# EAGLE schematic Stealthboard TMC2100 (EAGLE 8.1.0)

## Sheet 1 of 6: ICU- LPC1769/ VIN
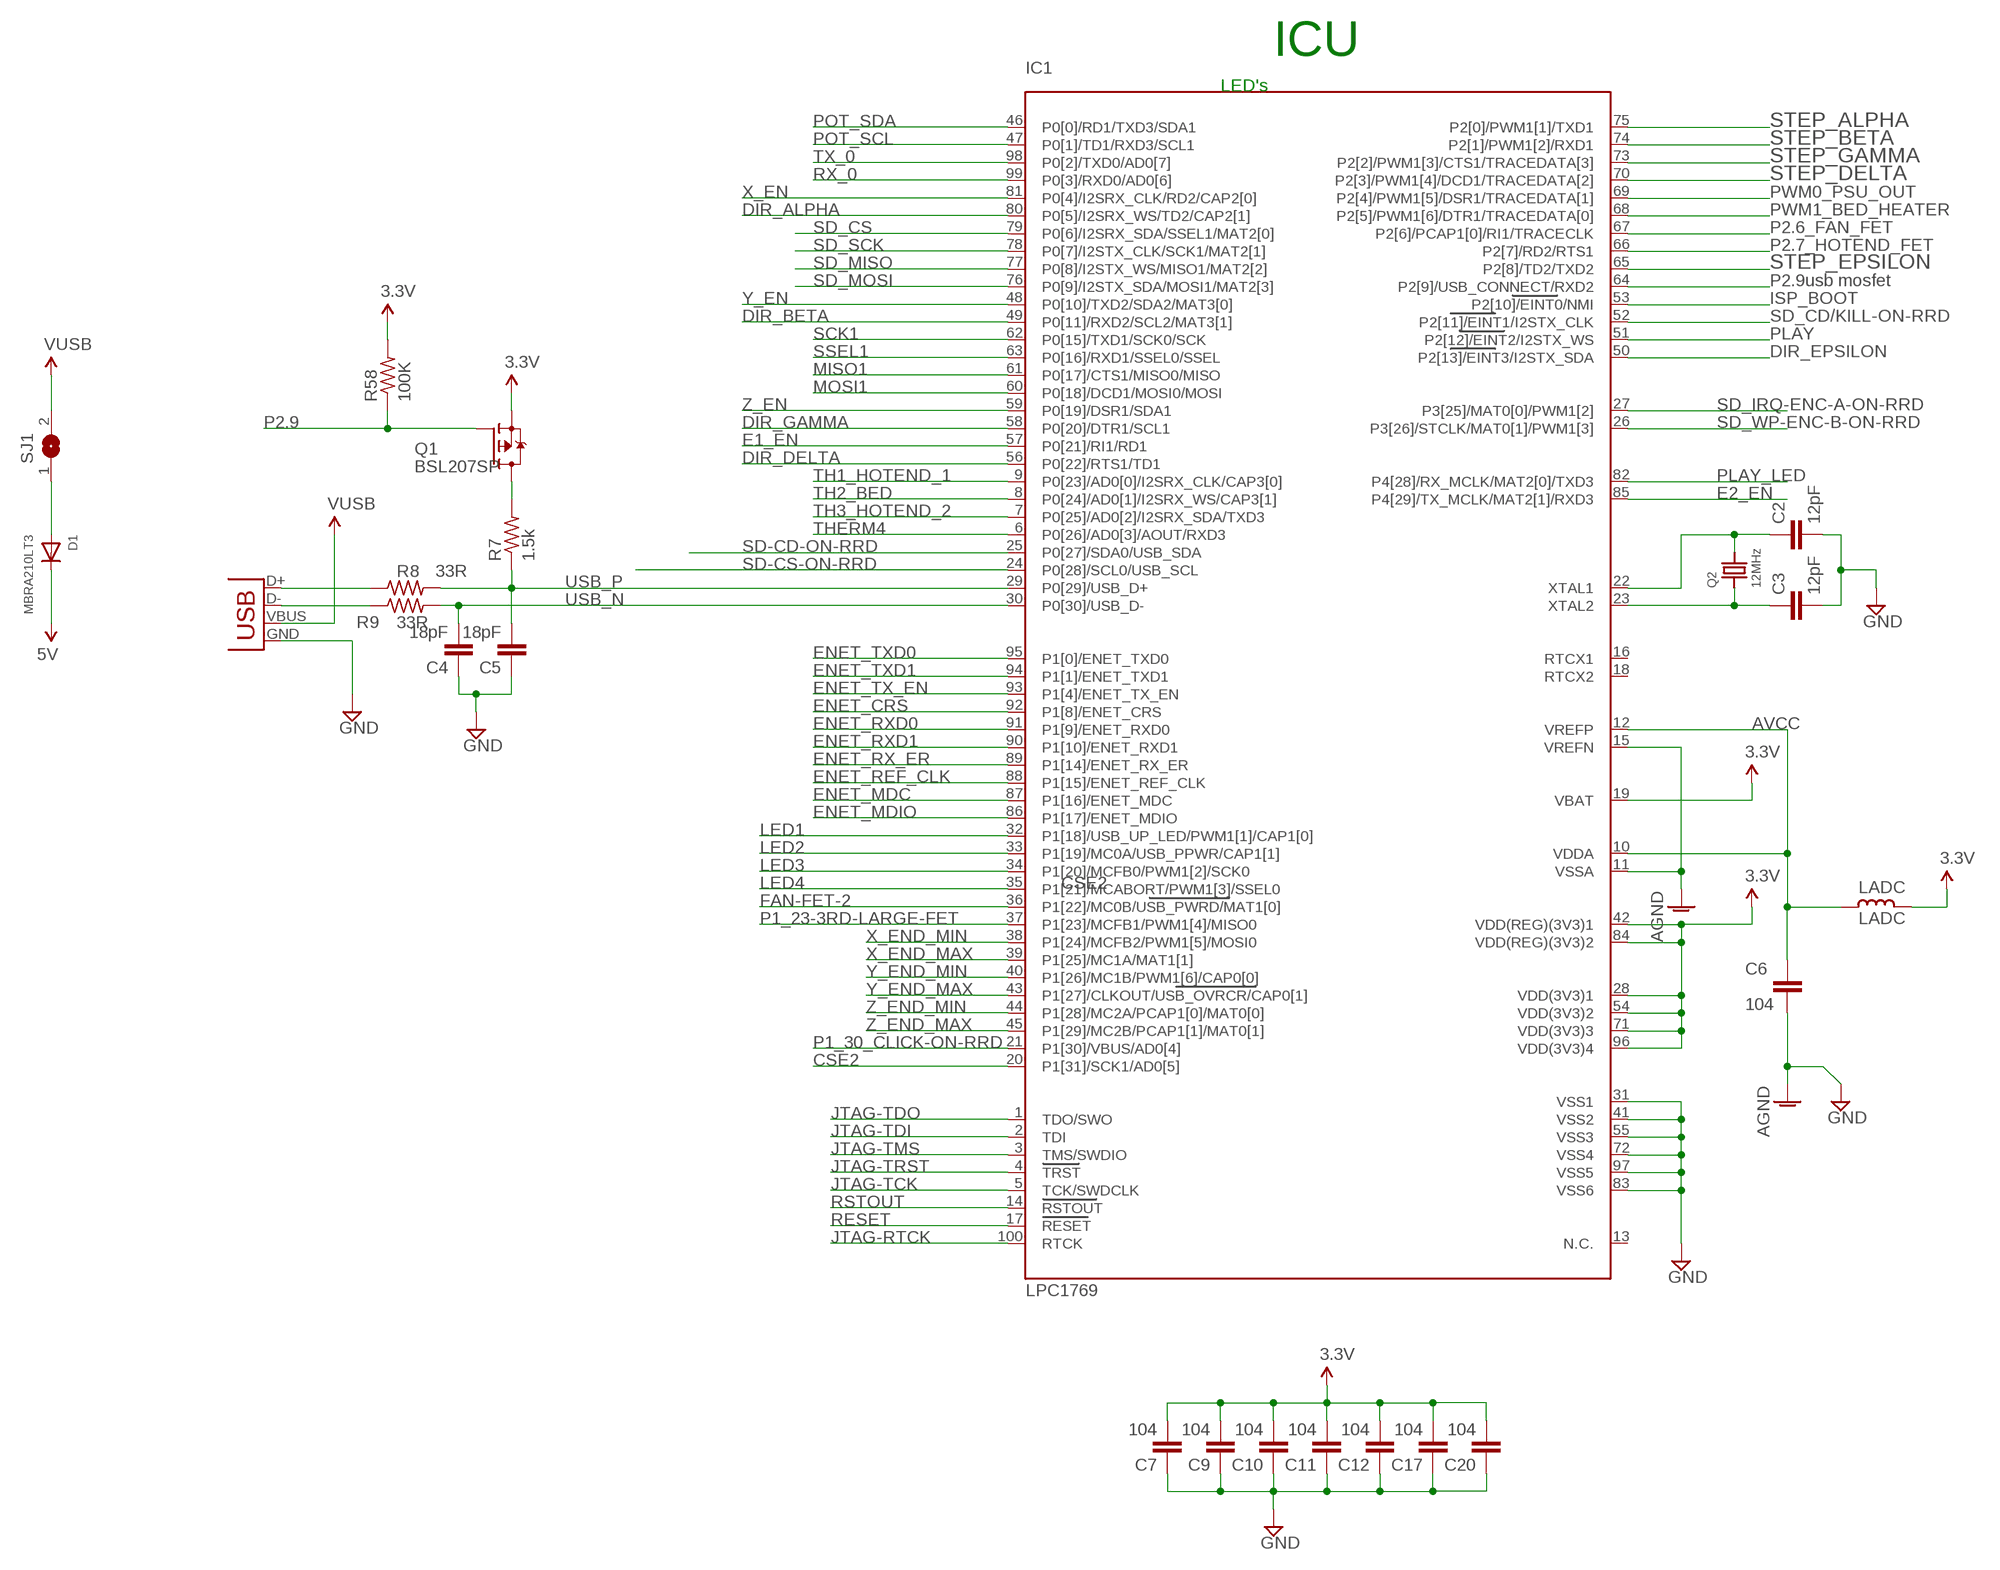
[diagram p0: schematic, sheet 1]

### Parts
C2  12pF  C-EUC0402  [C0402]
C3  12pF  C-EUC0402  [C0402]
C4  18pF  C-EUC0402  [C0402]
C5  18pF  C-EUC0402  [C0402]
C6  104  C-EUC0402  [C0402]
C7  104  C-EUC0402  [C0402]
C9  104  C-EUC0402  [C0402]
C10  104  C-EUC0402  [C0402]
C11  104  C-EUC0402  [C0402]
C12  104  C-EUC0402  [C0402]
C17  104  C-EUC0402  [C0402]
C20  104  C-EUC0402  [C0402]
D1  MBRA210LT3  DIODESMA  [SMADIODE]
IC1  LPC1769  LPC1768  [LQFP100]
LADC  LADC  L_  [L0402_LPT]
Q1  BSL207SP  [SC74_INFINEON]
Q2  12MHz  CRYSTALTHIN  [CRYSTAL_3.2X2.5]
R7  1.5k  R-US_R0402  [R0402]
R8  33R  R-US_R0402  [R0402]
R9  33R  R-US_R0402  [R0402]
R58  100K  R-US_R0402  [R0402]
SJ1  SJ  [SJ]
X14  USBPTH  [USB-B-PTH]

### Nets
3.3V: C7.2 C9.2 C10.2 C11.2 C12.2 C17.2 C20.2 IC1.19(VBAT) IC1.28(VDD(3V3)1) IC1.42(VDD(REG)(3V3)1) IC1.54(VDD(3V3)2) IC1.71(VDD(3V3)3) IC1.84(VDD(REG)(3V3)2) IC1.96(VDD(3V3)4) LADC.1 Q1.4(S) R58.2 ; also sheet 2,3,5,6
5V: D1.C ; also sheet 3,4,5,6
AGND: C6.2 IC1.11(VSSA) IC1.15(VREFN) ; supply symbol labelled GND ; also sheet 6
AVCC: C6.1 IC1.10(VDDA) IC1.12(VREFP) LADC.2 ; also sheet 6
CSE2: IC1.20(P1[31]/SCK1/AD0[5])
DIR_ALPHA: IC1.80(P0[5]/I2SRX_WS/TD2/CAP2[1]) ; also sheet 2
DIR_BETA: IC1.49(P0[11]/RXD2/SCL2/MAT3[1]) ; also sheet 2
DIR_DELTA: IC1.56(P0[22]/RTS1/TD1) ; also sheet 2
DIR_EPSILON: IC1.50(P2[13]/EINT3/I2STX_SDA) ; also sheet 2
DIR_GAMMA: IC1.58(P0[20]/DTR1/SCL1) ; also sheet 2
E1_EN: IC1.57(P0[21]/RI1/RD1) ; also sheet 2
E2_EN: IC1.85(P4[29]/TX_MCLK/MAT2[1]/RXD3) ; also sheet 2
ENET_CRS: IC1.92(P1[8]/ENET_CRS) ; also sheet 5
ENET_MDC: IC1.87(P1[16]/ENET_MDC) ; also sheet 5
ENET_MDIO: IC1.86(P1[17]/ENET_MDIO) ; also sheet 5
ENET_REF_CLK: IC1.88(P1[15]/ENET_REF_CLK) ; also sheet 5
ENET_RX_ER: IC1.89(P1[14]/ENET_RX_ER)
ENET_RXD0: IC1.91(P1[9]/ENET_RXD0) ; also sheet 5
ENET_RXD1: IC1.90(P1[10]/ENET_RXD1) ; also sheet 5
ENET_TX_EN: IC1.93(P1[4]/ENET_TX_EN) ; also sheet 5
ENET_TXD0: IC1.95(P1[0]/ENET_TXD0) ; also sheet 5
ENET_TXD1: IC1.94(P1[1]/ENET_TXD1) ; also sheet 5
FAN-FET-2: IC1.36(P1[22]/MC0B/USB_PWRD/MAT1[0]) ; also sheet 4
GND: C2.2 C3.2 C4.1 C5.1 C7.1 C9.1 C10.1 C11.1 C12.1 C17.1 C20.1 IC1.31(VSS1) IC1.41(VSS2) IC1.55(VSS3) IC1.72(VSS4) IC1.83(VSS6) IC1.97(VSS5) X14.GND ; also sheet 2,3,4,5,6
ISP_BOOT: IC1.53(P2[10]/EINT0/NMI) ; also sheet 5
JTAG-RTCK: IC1.100(RTCK)
JTAG-TCK: IC1.5(TCK/SWDCLK)
JTAG-TDI: IC1.2(TDI)
JTAG-TDO: IC1.1(TDO/SWO)
JTAG-TMS: IC1.3(TMS/SWDIO)
JTAG-TRST: IC1.4(TRST)
LED1: IC1.32(P1[18]/USB_UP_LED/PWM1[1]/CAP1[0]) ; also sheet 6
LED2: IC1.33(P1[19]/MC0A/USB_PPWR/CAP1[1]) ; also sheet 6
LED3: IC1.34(P1[20]/MCFB0/PWM1[2]/SCK0) ; also sheet 6
LED4: IC1.35(P1[21]/MCABORT/PWM1[3]/SSEL0) ; also sheet 6
MISO1: IC1.61(P0[17]/CTS1/MISO0/MISO) ; also sheet 5
MOSI1: IC1.60(P0[18]/DCD1/MOSI0/MOSI) ; also sheet 5
N$1: C2.1 IC1.22(XTAL1) Q2.2
N$2: C3.1 IC1.23(XTAL2) Q2.1
N$39: D1.A SJ1.1
N$51: Q1.1(D) Q1.2(D) Q1.5(D) Q1.6(D) R7.2
N$61: R8.1 X14.D+
N$62: R9.1 X14.D-
P1_23-3RD-LARGE-FET: IC1.37(P1[23]/MCFB1/PWM1[4]/MISO0) ; also sheet 4
P1_30_CLICK-ON-RRD: IC1.21(P1[30]/VBUS/AD0[4]) ; also sheet 5
P2.6_FAN_FET: IC1.67(P2[6]/PCAP1[0]/RI1/TRACECLK) ; also sheet 4
P2.7_HOTEND_FET: IC1.66(P2[7]/RD2/RTS1) ; also sheet 4
P2.9: IC1.64(P2[9]/USB_CONNECT/RXD2) Q1.3(G) R58.1
PLAY: IC1.51(P2[12]/EINT2/I2STX_WS) ; also sheet 5
PLAY_LED: IC1.82(P4[28]/RX_MCLK/MAT2[0]/TXD3) ; also sheet 6
POT_SCL: IC1.47(P0[1]/TD1/RXD3/SCL1) ; also sheet 2
POT_SDA: IC1.46(P0[0]/RD1/TXD3/SDA1) ; also sheet 2
PWM0_PSU_OUT: IC1.69(P2[4]/PWM1[5]/DSR1/TRACEDATA[1]) ; also sheet 5
PWM1_BED_HEATER: IC1.68(P2[5]/PWM1[6]/DTR1/TRACEDATA[0]) ; also sheet 4
RESET: IC1.17(RESET) ; also sheet 5
RSTOUT: IC1.14(RSTOUT)
RX_0: IC1.99(P0[3]/RXD0/AD0[6]) ; also sheet 5
SCK1: IC1.62(P0[15]/TXD1/SCK0/SCK) ; also sheet 5
SD-CD-ON-RRD: IC1.25(P0[27]/SDA0/USB_SDA) ; also sheet 5
SD-CS-ON-RRD: IC1.24(P0[28]/SCL0/USB_SCL) ; also sheet 5
SD_CD/KILL-ON-RRD: IC1.52(P2[11]/EINT1/I2STX_CLK) ; also sheet 5
SD_CS: IC1.79(P0[6]/I2SRX_SDA/SSEL1/MAT2[0]) ; also sheet 5
SD_IRQ-ENC-A-ON-RRD: IC1.27(P3[25]/MAT0[0]/PWM1[2]) ; also sheet 5
SD_MISO: IC1.77(P0[8]/I2STX_WS/MISO1/MAT2[2]) ; also sheet 5
SD_MOSI: IC1.76(P0[9]/I2STX_SDA/MOSI1/MAT2[3]) ; also sheet 5
SD_SCK: IC1.78(P0[7]/I2STX_CLK/SCK1/MAT2[1]) ; also sheet 5
SD_WP-ENC-B-ON-RRD: IC1.26(P3[26]/STCLK/MAT0[1]/PWM1[3]) ; also sheet 5
SSEL1: IC1.63(P0[16]/RXD1/SSEL0/SSEL) ; also sheet 5
STEP_ALPHA: IC1.75(P2[0]/PWM1[1]/TXD1) ; also sheet 2
STEP_BETA: IC1.74(P2[1]/PWM1[2]/RXD1) ; also sheet 2
STEP_DELTA: IC1.70(P2[3]/PWM1[4]/DCD1/TRACEDATA[2]) ; also sheet 2
STEP_EPSILON: IC1.65(P2[8]/TD2/TXD2) ; also sheet 2
STEP_GAMMA: IC1.73(P2[2]/PWM1[3]/CTS1/TRACEDATA[3]) ; also sheet 2
TH1_HOTEND_1: IC1.9(P0[23]/AD0[0]/I2SRX_CLK/CAP3[0]) ; also sheet 6
TH2_BED: IC1.8(P0[24]/AD0[1]/I2SRX_WS/CAP3[1]) ; also sheet 6
TH3_HOTEND_2: IC1.7(P0[25]/AD0[2]/I2SRX_SDA/TXD3) ; also sheet 6
THERM4: IC1.6(P0[26]/AD0[3]/AOUT/RXD3)
TX_0: IC1.98(P0[2]/TXD0/AD0[7]) ; also sheet 5
USB_N: C4.2 IC1.30(P0[30]/USB_D-) R9.2
USB_P: C5.2 IC1.29(P0[29]/USB_D+) R7.1 R8.2
VUSB: SJ1.2 X14.VBUS
X_EN: IC1.81(P0[4]/I2SRX_CLK/RD2/CAP2[0]) ; also sheet 2
X_END_MAX: IC1.39(P1[25]/MC1A/MAT1[1])
X_END_MIN: IC1.38(P1[24]/MCFB2/PWM1[5]/MOSI0) ; also sheet 6
Y_EN: IC1.48(P0[10]/TXD2/SDA2/MAT3[0]) ; also sheet 2
Y_END_MAX: IC1.43(P1[27]/CLKOUT/USB_OVRCR/CAP0[1])
Y_END_MIN: IC1.40(P1[26]/MC1B/PWM1[6]/CAP0[0]) ; also sheet 6
Z_EN: IC1.59(P0[19]/DSR1/SDA1) ; also sheet 2
Z_END_MAX: IC1.45(P1[29]/MC2B/PCAP1[1]/MAT0[1]) ; also sheet 6
Z_END_MIN: IC1.44(P1[28]/MC2A/PCAP1[0]/MAT0[0]) ; also sheet 6
Unconnected: IC1.13(N.C.) IC1.16(RTCX1) IC1.18(RTCX2)

### Notes on the sheet
- ICU
- LED's
- usb mosfet

## Sheet 2 of 6: Trinamic/TMC 2100 Motor Drivers
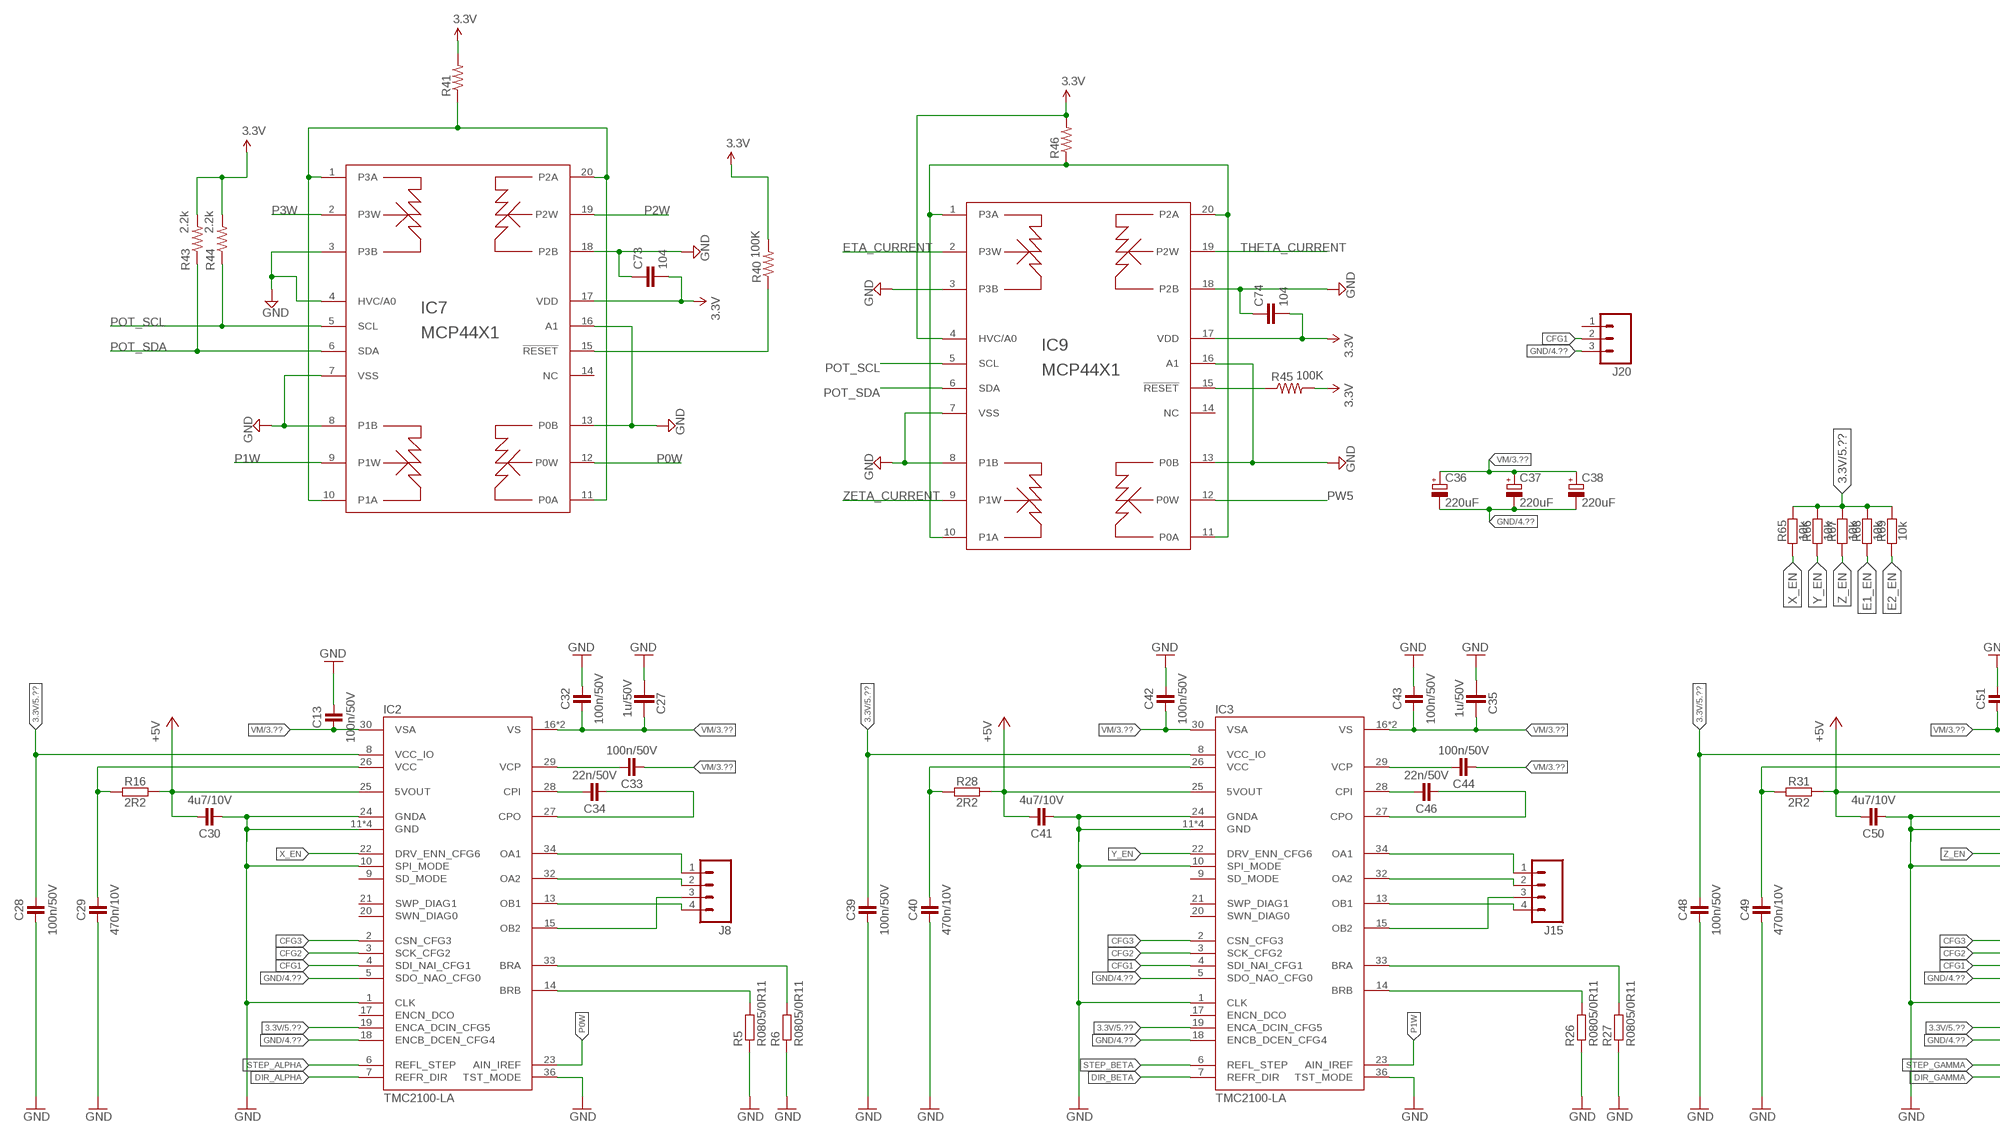
[diagram p1: schematic, sheet 2, part 1 of 2]
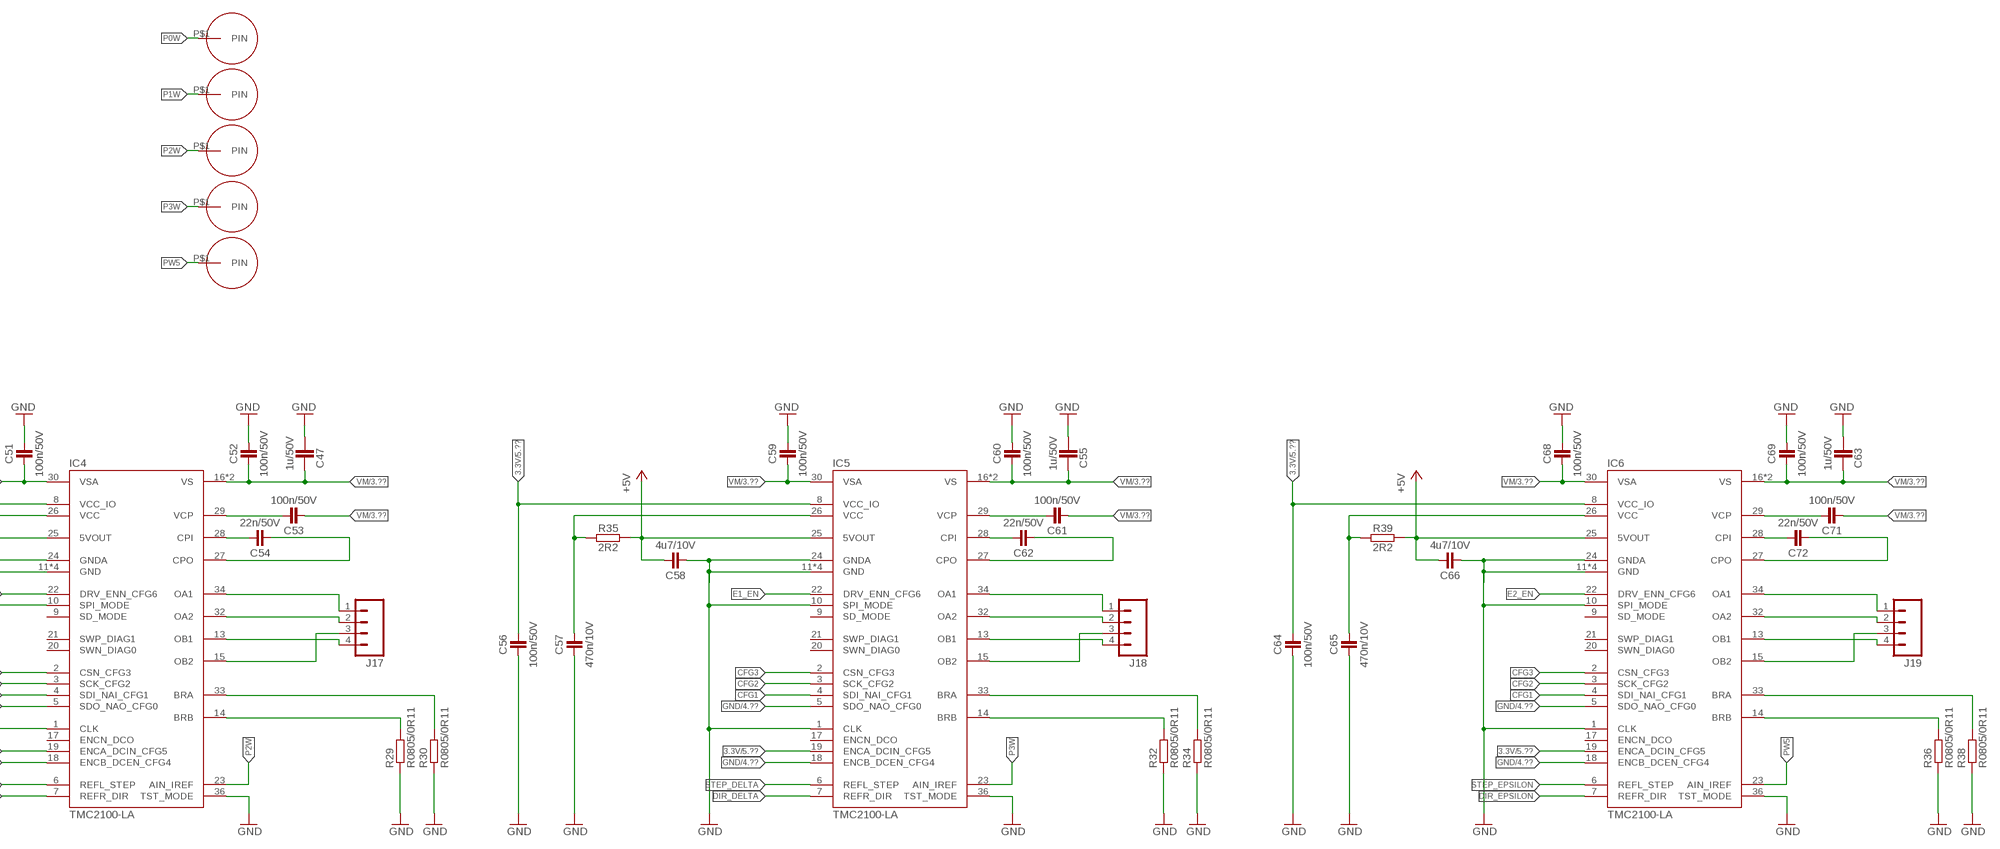
[diagram p2: schematic, sheet 2, part 2 of 2]

### Parts
C13  100n/50V  CAPACITOR-0402  [C0402]
C27  1u/50V  C-EUC0603  [C0603]
C28  100n/50V  CAPACITOR-0402  [C0402]
C29  470n/10V  CAPACITOR-0402  [C0402]
C30  4u7/10V  CAPACITOR-0402  [C0402]
C32  100n/50V  CAPACITOR-0402  [C0402]
C33  100n/50V  CAPACITOR-0402  [C0402]
C34  22n/50V  CAPACITOR-0402  [C0402]
C35  1u/50V  C-EUC0603  [C0603]
C36  220uF  CPOL-EU153CLV-0807  [153CLV-0807]
C37  220uF  CPOL-EU153CLV-0807  [153CLV-0807]
C38  220uF  CPOL-EU153CLV-0807  [153CLV-0807]
C39  100n/50V  CAPACITOR-0402  [C0402]
C40  470n/10V  CAPACITOR-0402  [C0402]
C41  4u7/10V  CAPACITOR-0402  [C0402]
C42  100n/50V  CAPACITOR-0402  [C0402]
C43  100n/50V  CAPACITOR-0402  [C0402]
C44  100n/50V  CAPACITOR-0402  [C0402]
C46  22n/50V  CAPACITOR-0402  [C0402]
C47  1u/50V  C-EUC0603  [C0603]
C48  100n/50V  CAPACITOR-0402  [C0402]
C49  470n/10V  CAPACITOR-0402  [C0402]
C50  4u7/10V  CAPACITOR-0402  [C0402]
C51  100n/50V  CAPACITOR-0402  [C0402]
C52  100n/50V  CAPACITOR-0402  [C0402]
C53  100n/50V  CAPACITOR-0402  [C0402]
C54  22n/50V  CAPACITOR-0402  [C0402]
C55  1u/50V  C-EUC0603  [C0603]
C56  100n/50V  CAPACITOR-0402  [C0402]
C57  470n/10V  CAPACITOR-0402  [C0402]
C58  4u7/10V  CAPACITOR-0402  [C0402]
C59  100n/50V  CAPACITOR-0402  [C0402]
C60  100n/50V  CAPACITOR-0402  [C0402]
C61  100n/50V  CAPACITOR-0402  [C0402]
C62  22n/50V  CAPACITOR-0402  [C0402]
C63  1u/50V  C-EUC0603  [C0603]
C64  100n/50V  CAPACITOR-0402  [C0402]
C65  470n/10V  CAPACITOR-0402  [C0402]
C66  4u7/10V  CAPACITOR-0402  [C0402]
C68  100n/50V  CAPACITOR-0402  [C0402]
C69  100n/50V  CAPACITOR-0402  [C0402]
C71  100n/50V  CAPACITOR-0402  [C0402]
C72  22n/50V  CAPACITOR-0402  [C0402]
C73  104  C-EUC0402  [C0402]
C74  104  C-EUC0402  [C0402]
IC2  TMC2100-LA  TMC21X0-LA  [QFN36-PAD]
IC3  TMC2100-LA  TMC21X0-LA  [QFN36-PAD]
IC4  TMC2100-LA  TMC21X0-LA  [QFN36-PAD]
IC5  TMC2100-LA  TMC21X0-LA  [QFN36-PAD]
IC6  TMC2100-LA  TMC21X0-LA  [QFN36-PAD]
IC7  MCP44X1  [TSSOP20]
IC9  MCP44X1  [TSSOP20]
J8  M04POLAR_LOCK  [MOLEX-1X4_LOCK]
J15  M04POLAR_LOCK  [MOLEX-1X4_LOCK]
J17  M04POLAR_LOCK  [MOLEX-1X4_LOCK]
J18  M04POLAR_LOCK  [MOLEX-1X4_LOCK]
J19  M04POLAR_LOCK  [MOLEX-1X4_LOCK]
J20  M03PTH  [1X03]
R5  R0805/0R11  R-EU_M0805  [M0805]
R6  R0805/0R11  R-EU_M0805  [M0805]
R16  2R2  RESISTOR-0402  [C0402]
R26  R0805/0R11  R-EU_M0805  [M0805]
R27  R0805/0R11  R-EU_M0805  [M0805]
R28  2R2  RESISTOR-0402  [C0402]
R29  R0805/0R11  R-EU_M0805  [M0805]
R30  R0805/0R11  R-EU_M0805  [M0805]
R31  2R2  RESISTOR-0402  [C0402]
R32  R0805/0R11  R-EU_M0805  [M0805]
R34  R0805/0R11  R-EU_M0805  [M0805]
R35  2R2  RESISTOR-0402  [C0402]
R36  R0805/0R11  R-EU_M0805  [M0805]
R38  R0805/0R11  R-EU_M0805  [M0805]
R39  2R2  RESISTOR-0402  [C0402]
R40  100K  R-US_R0402  [R0402]
R41  R-US_R0402  [R0402]
R43  2.2k  R-US_R0402  [R0402]
R44  2.2k  R-US_R0402  [R0402]
R45  100K  R-US_R0402  [R0402]
R46  R-US_R0402  [R0402]
R65  10k  RESISTOR-0402  [C0402]
R66  10k  RESISTOR-0402  [C0402]
R67  10k  RESISTOR-0402  [C0402]
R68  10k  RESISTOR-0402  [C0402]
R69  10k  RESISTOR-0402  [C0402]
U$8  SMALL_PAD  [SMALL_PAD]
U$9  SMALL_PAD  [SMALL_PAD]
U$10  SMALL_PAD  [SMALL_PAD]
U$11  SMALL_PAD  [SMALL_PAD]
U$12  SMALL_PAD  [SMALL_PAD]

### Nets
3.3V: C28.2 C39.2 C48.2 C56.2 C64.2 C73.2 C74.2 IC2.8(VCC_IO) IC2.19(ENCA_DCIN_CFG5) IC3.8(VCC_IO) IC3.19(ENCA_DCIN_CFG5) IC4.8(VCC_IO) IC4.19(ENCA_DCIN_CFG5) IC5.8(VCC_IO) IC5.19(ENCA_DCIN_CFG5) IC6.8(VCC_IO) IC6.19(ENCA_DCIN_CFG5) IC7.17(VDD) IC9.4(HVC/A0) IC9.17(VDD) R40.2 R41.2 R43.2 R44.2 R45.2 R46.2 R65.2 R66.2 R67.2 R68.2 R69.2 ; also sheet 1,3,5,6
+5V: C30.2 C41.2 C50.2 C58.2 C66.2 IC2.25(5VOUT) IC3.25(5VOUT) IC4.25(5VOUT) IC5.25(5VOUT) IC6.25(5VOUT) R16.2 R28.2 R31.2 R35.2 R39.2
BRA: IC2.33(BRA) R6.2
BRA1: IC3.33(BRA) R27.2
BRA2: IC4.33(BRA) R30.2
BRA3: IC5.33(BRA) R34.2
BRA4: IC6.33(BRA) R38.2
BRB: IC2.14(BRB) R5.2
BRB1: IC3.14(BRB) R26.2
BRB2: IC4.14(BRB) R29.2
BRB3: IC5.14(BRB) R32.2
BRB4: IC6.14(BRB) R36.2
CFG1: IC2.4(SDI_NAI_CFG1) IC3.4(SDI_NAI_CFG1) IC4.4(SDI_NAI_CFG1) IC5.4(SDI_NAI_CFG1) IC6.4(SDI_NAI_CFG1) J20.2
CFG2: IC2.3(SCK_CFG2) IC3.3(SCK_CFG2) IC4.3(SCK_CFG2) IC5.3(SCK_CFG2) IC6.3(SCK_CFG2)
CFG3: IC2.2(CSN_CFG3) IC3.2(CSN_CFG3) IC4.2(CSN_CFG3) IC5.2(CSN_CFG3) IC6.2(CSN_CFG3)
CPI: C34.2 IC2.28(CPI)
CPI1: C46.2 IC3.28(CPI)
CPI2: C54.2 IC4.28(CPI)
CPI3: C62.2 IC5.28(CPI)
CPI4: C72.2 IC6.28(CPI)
CPO: C34.1 IC2.27(CPO)
CPO1: C46.1 IC3.27(CPO)
CPO2: C54.1 IC4.27(CPO)
CPO3: C62.1 IC5.27(CPO)
CPO4: C72.1 IC6.27(CPO)
DIR_ALPHA: IC2.7(REFR_DIR) ; also sheet 1
DIR_BETA: IC3.7(REFR_DIR) ; also sheet 1
DIR_DELTA: IC5.7(REFR_DIR) ; also sheet 1
DIR_EPSILON: IC6.7(REFR_DIR) ; also sheet 1
DIR_GAMMA: IC4.7(REFR_DIR) ; also sheet 1
E1_EN: IC5.22(DRV_ENN_CFG6) R68.1 ; also sheet 1
E2_EN: IC6.22(DRV_ENN_CFG6) R69.1 ; also sheet 1
ETA_CURRENT: IC9.2(P3W)
GND: C13.2 C27.2 C28.1 C29.1 C30.1 C32.2 C35.2 C36.- C37.- C38.- C39.1 C40.1 C41.1 C42.2 C43.2 C47.2 C48.1 C49.1 C50.1 C51.2 C52.2 C55.2 C56.1 C57.1 C58.1 C59.2 C60.2 C63.2 C64.1 C65.1 C66.1 C68.2 C69.2 C73.1 C74.1 IC2.1(CLK) IC2.5(SDO_NAO_CFG0) IC2.10(SPI_MODE) IC2.11(GND) IC2.12(GND) IC2.18(ENCB_DCEN_CFG4) IC2.24(GNDA) IC2.35(GND) IC2.36(TST_MODE) IC2.TP(GND) IC3.1(CLK) IC3.5(SDO_NAO_CFG0) IC3.10(SPI_MODE) IC3.11(GND) IC3.12(GND) IC3.18(ENCB_DCEN_CFG4) IC3.24(GNDA) IC3.35(GND) IC3.36(TST_MODE) IC3.TP(GND) IC4.1(CLK) IC4.5(SDO_NAO_CFG0) IC4.10(SPI_MODE) IC4.11(GND) IC4.12(GND) IC4.18(ENCB_DCEN_CFG4) IC4.24(GNDA) IC4.35(GND) IC4.36(TST_MODE) IC4.TP(GND) IC5.1(CLK) IC5.5(SDO_NAO_CFG0) IC5.10(SPI_MODE) IC5.11(GND) IC5.12(GND) IC5.18(ENCB_DCEN_CFG4) IC5.24(GNDA) IC5.35(GND) IC5.36(TST_MODE) IC5.TP(GND) IC6.1(CLK) IC6.5(SDO_NAO_CFG0) IC6.10(SPI_MODE) IC6.11(GND) IC6.12(GND) IC6.18(ENCB_DCEN_CFG4) IC6.24(GNDA) IC6.35(GND) IC6.36(TST_MODE) IC6.TP(GND) IC7.3(P3B) IC7.4(HVC/A0) IC7.7(VSS) IC7.8(P1B) IC7.13(P0B) IC7.16(A1) IC7.18(P2B) IC9.3(P3B) IC9.7(VSS) IC9.8(P1B) IC9.13(P0B) IC9.16(A1) IC9.18(P2B) J20.3 R5.1 R6.1 R26.1 R27.1 R29.1 R30.1 R32.1 R34.1 R36.1 R38.1 ; also sheet 1,3,4,5,6
N$22: IC7.15(!RESET) R40.1
N$23: IC7.1(P3A) IC7.10(P1A) IC7.11(P0A) IC7.20(P2A) R41.1
N$29: IC9.15(!RESET) R45.1
N$31: C29.2 IC2.26(VCC) R16.1
N$36: IC9.1(P3A) IC9.10(P1A) IC9.11(P0A) IC9.20(P2A) R46.1
OA1: IC2.34(OA1) IC3.34(OA1) IC4.34(OA1) IC5.34(OA1) IC6.34(OA1) J8.1 J15.1 J17.1 J18.1 J19.1
OA2: IC2.32(OA2) IC3.32(OA2) IC4.32(OA2) IC5.32(OA2) IC6.32(OA2) J8.2 J15.2 J17.2 J18.2 J19.2
OB1: IC2.13(OB1) IC3.13(OB1) IC4.13(OB1) IC5.13(OB1) IC6.13(OB1) J8.4 J15.4 J17.4 J18.4 J19.4
OB2: IC2.15(OB2) IC3.15(OB2) IC4.15(OB2) IC5.15(OB2) IC6.15(OB2) J8.3 J15.3 J17.3 J18.3 J19.3
P0W: IC2.23(AIN_IREF) IC7.12(P0W) U$8.P$1(PIN)
P1W: IC3.23(AIN_IREF) IC7.9(P1W) U$9.P$1(PIN)
P2W: IC4.23(AIN_IREF) IC7.19(P2W) U$10.P$1(PIN)
P3W: IC5.23(AIN_IREF) IC7.2(P3W) U$11.P$1(PIN)
POT_SCL: IC7.5(SCL) IC9.5(SCL) R44.1 ; also sheet 1
POT_SDA: IC7.6(SDA) IC9.6(SDA) R43.1 ; also sheet 1
PW5: IC6.23(AIN_IREF) IC9.12(P0W) U$12.P$1(PIN)
STEP_ALPHA: IC2.6(REFL_STEP) ; also sheet 1
STEP_BETA: IC3.6(REFL_STEP) ; also sheet 1
STEP_DELTA: IC5.6(REFL_STEP) ; also sheet 1
STEP_EPSILON: IC6.6(REFL_STEP) ; also sheet 1
STEP_GAMMA: IC4.6(REFL_STEP) ; also sheet 1
THETA_CURRENT: IC9.19(P2W)
VCC1: C40.2 IC3.26(VCC) R28.1
VCC2: C49.2 IC4.26(VCC) R31.1
VCC3: C57.2 IC5.26(VCC) R35.1
VCC4: C65.2 IC6.26(VCC) R39.1
VCP: C33.2 IC2.29(VCP)
VCP1: C44.2 IC3.29(VCP)
VCP2: C53.2 IC4.29(VCP)
VCP3: C61.2 IC5.29(VCP)
VCP4: C71.2 IC6.29(VCP)
VM: C13.1 C27.1 C32.1 C33.1 C35.1 C36.+ C37.+ C38.+ C42.1 C43.1 C44.1 C47.1 C51.1 C52.1 C53.1 C55.1 C59.1 C60.1 C61.1 C63.1 C68.1 C69.1 C71.1 IC2.16(VS) IC2.30(VSA) IC2.31(VS) IC3.16(VS) IC3.30(VSA) IC3.31(VS) IC4.16(VS) IC4.30(VSA) IC4.31(VS) IC5.16(VS) IC5.30(VSA) IC5.31(VS) IC6.16(VS) IC6.30(VSA) IC6.31(VS) ; also sheet 3,4,5,6
X_EN: IC2.22(DRV_ENN_CFG6) R65.1 ; also sheet 1
Y_EN: IC3.22(DRV_ENN_CFG6) R66.1 ; also sheet 1
Z_EN: IC4.22(DRV_ENN_CFG6) R67.1 ; also sheet 1
ZETA_CURRENT: IC9.9(P1W)
Unconnected: IC2.9(SD_MODE) IC2.17(ENCN_DCO) IC2.20(SWN_DIAG0) IC2.21(SWP_DIAG1) IC3.9(SD_MODE) IC3.17(ENCN_DCO) IC3.20(SWN_DIAG0) IC3.21(SWP_DIAG1) IC4.9(SD_MODE) IC4.17(ENCN_DCO) IC4.20(SWN_DIAG0) IC4.21(SWP_DIAG1) IC5.9(SD_MODE) IC5.17(ENCN_DCO) IC5.20(SWN_DIAG0) IC5.21(SWP_DIAG1) IC6.9(SD_MODE) IC6.17(ENCN_DCO) IC6.20(SWN_DIAG0) IC6.21(SWP_DIAG1) IC7.14(NC) IC9.14(NC) J20.1

## Sheet 3 of 6: Buck Regulator/Linear Regulator
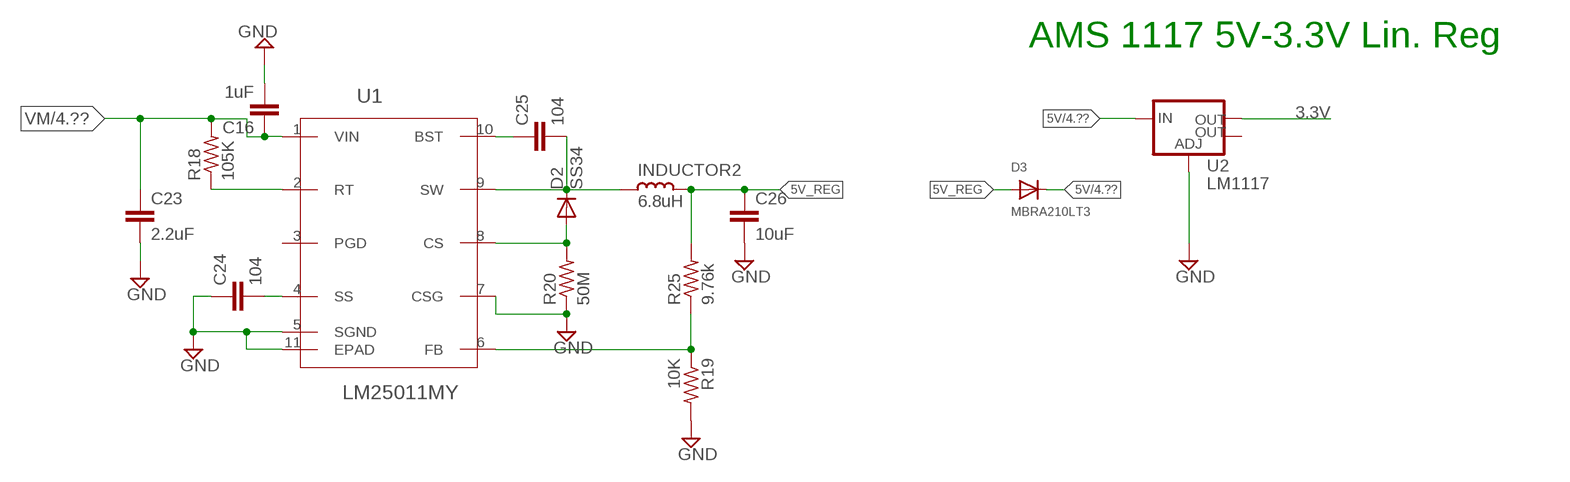
[diagram p3: schematic, sheet 3]

### Parts
C16  1uF  C-EUC0805  [C0805]
C23  2.2uF  C-EUC1206  [C1206]
C24  104  C-EUC0805  [C0805]
C25  104  C-EUC0805  [C0805]
C26  10uF  C-EUC0603  [C0603]
D2  SS34  DIODE-DO-214AC  [DO-214AC]
D3  MBRA210LT3  DIODESMA  [SMADIODE]
INDUCTOR2  6.8uH  L_CD75  [CD75]
R18  105K  R-US_R0402  [R0402]
R19  10K  R-US_R0402  [R0402]
R20  50M  R-US_R0805  [R0805]
R25  9.76k  R-US_R0805  [R0805]
U1  LM25011MY  [SOP50P490X110-11N]
U2  LM1117  V_REG_LM1117SOT223  [SOT223]

### Nets
3.3V: U2.2(OUT) ; also sheet 1,2,5,6
5V: D3.C U2.3(IN) ; also sheet 1,4,5,6
5V_REG: C26.1 D3.A INDUCTOR2.1 R25.2
GND: C16.2 C23.2 C24.1 C26.2 R19.2 R20.1 U1.5(SGND) U1.7(CSG) U1.11(EPAD) U2.1(ADJ) ; also sheet 1,2,4,5,6
N$7: R18.1 U1.2(RT)
N$14: R19.1 R25.1 U1.6(FB)
N$15: C24.2 U1.4(SS)
N$16: C25.1 U1.10(BST)
N$20: C25.2 D2.1(C) INDUCTOR2.2 U1.9(SW)
N$21: D2.2(A) R20.2 U1.8(CS)
VM: C16.1 C23.1 R18.2 U1.1(VIN) ; also sheet 2,4,5,6
Unconnected: U1.3(PGD) U2.4(OUT)

### Notes on the sheet
- AMS 1117 5V-3.3V Lin. Reg

## Sheet 4 of 6: Mosfets (High Current and Fan)
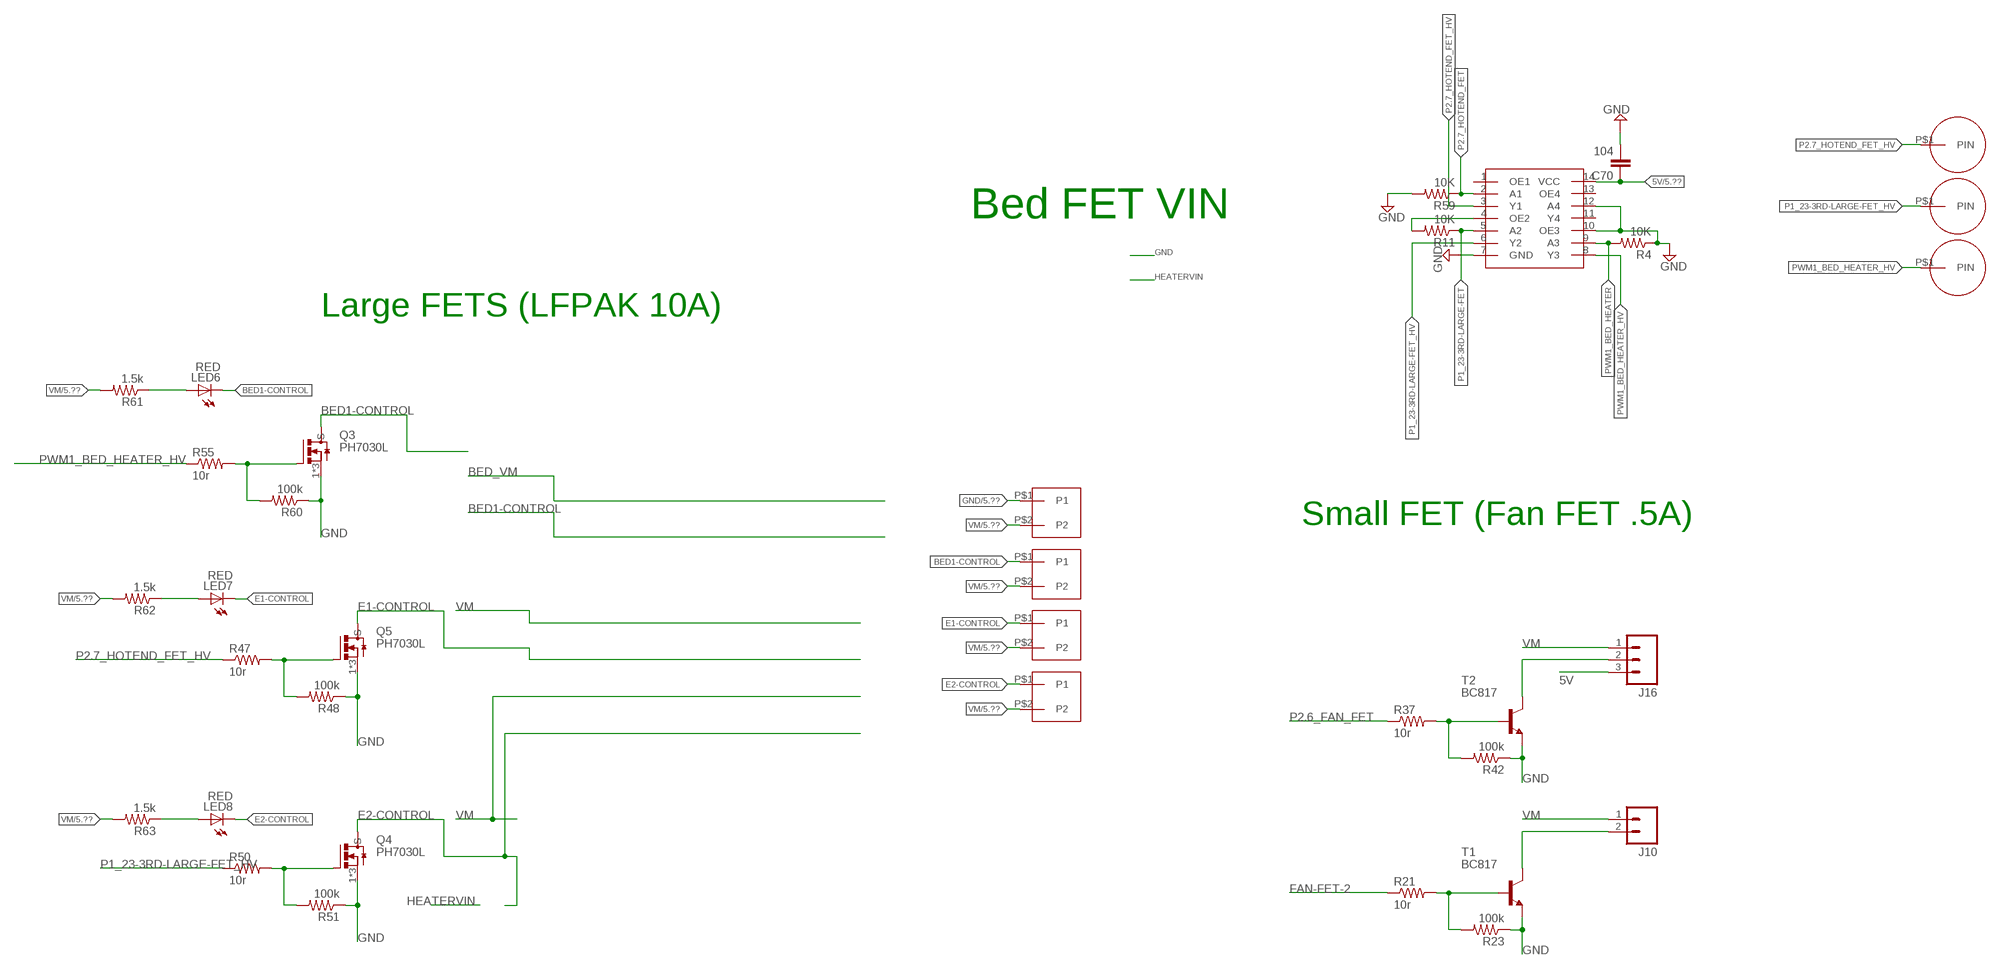
[diagram p4: schematic, sheet 4]

### Parts
C70  104  C-EUC0402  [C0402]
J10  M02POLAR_LOCK  [MOLEX-1X2_LOCK]
J16  M03POLAR_LOCK  [MOLEX-1X3_LOCK]
LED6  RED  LEDCHIP-LED0603  [CHIP-LED0603]
LED7  RED  LEDCHIP-LED0603  [CHIP-LED0603]
LED8  RED  LEDCHIP-LED0603  [CHIP-LED0603]
Q3  PH7030L  [SOT669]
Q4  PH7030L  [SOT669]
Q5  PH7030L  [SOT669]
R4  10K  R-US_R0402  [R0402]
R11  10K  R-US_R0402  [R0402]
R21  10r  R-US_R0402  [R0402]
R23  100k  R-US_R0402  [R0402]
R37  10r  R-US_R0402  [R0402]
R42  100k  R-US_R0402  [R0402]
R47  10r  R-US_R0402  [R0402]
R48  100k  R-US_R0402  [R0402]
R50  10r  R-US_R0402  [R0402]
R51  100k  R-US_R0402  [R0402]
R55  10r  R-US_R0402  [R0402]
R59  10K  R-US_R0402  [R0402]
R60  100k  R-US_R0402  [R0402]
R61  1.5k  R-US_R0402  [R0402]
R62  1.5k  R-US_R0402  [R0402]
R63  1.5k  R-US_R0402  [R0402]
T1  BC817  BC817-40-NPN-SOT23-BEC  [SOT23-BEC]
T2  BC817  BC817-40-NPN-SOT23-BEC  [SOT23-BEC]
U$1  KF635-6.35MM-2PKF635-2P  [KF635-6.35MM]
U$2  MC74VHCT125ADTRG  MC74VHCT125ADTRGMC74VHCT125ADTRG  [TSSOP-14]
U$4  KF635-6.35MM-2PKF635-2P  [KF635-6.35MM]
U$5  KF635-6.35MM-2PKF635-2P  [KF635-6.35MM]
U$6  KF635-6.35MM-2PKF635-2P  [KF635-6.35MM]
U$7  SMALL_PAD  [SMALL_PAD]
U$13  SMALL_PAD  [SMALL_PAD]
U$14  SMALL_PAD  [SMALL_PAD]

### Nets
5V: C70.1 J16.3 U$2.14(VCC) ; also sheet 1,3,5,6
BED1-CONTROL [3.3-Amp Class]: LED6.C Q3.MB(D) U$4.P$1(P1)
E1-CONTROL [3.3-Amp Class]: LED7.C Q5.MB(D) U$1.P$1(P1)
E2-CONTROL [3.3-Amp Class]: LED8.C Q4.MB(D) U$6.P$1(P1)
FAN-FET-2: R21.1 ; also sheet 1
GND: C70.2 Q3.1(S) Q3.2(S) Q3.3(S) Q4.1(S) Q4.2(S) Q4.3(S) Q5.1(S) Q5.2(S) Q5.3(S) R4.1 R23.1 R42.1 R48.1 R51.1 R59.2 R60.1 T1.E T2.E U$2.7(GND) U$2.10(OE3) U$2.12(A4) U$5.P$1(P1) ; also sheet 1,2,3,5,6
N$24: J10.2 T1.C
N$25: Q3.4(G) R55.2 R60.2
N$26: R37.2 R42.2 T2.B
N$27: R21.2 R23.2 T1.B
N$28: Q5.4(G) R47.2 R48.2
N$30: J16.2 T2.C
N$37: Q4.4(G) R50.2 R51.2
N$42: LED6.A R61.1
N$43: LED7.A R62.1
N$44: LED8.A R63.1
N$48: R11.2 U$2.4(OE2)
P1_23-3RD-LARGE-FET: R11.1 U$2.5(A2) ; also sheet 1
P1_23-3RD-LARGE-FET_HV: R50.1 U$2.6(Y2) U$13.P$1(PIN)
P2.6_FAN_FET: R37.1 ; also sheet 1
P2.7_HOTEND_FET: R59.1 U$2.2(A1) ; also sheet 1
P2.7_HOTEND_FET_HV: R47.1 U$2.3(Y1) U$7.P$1(PIN)
PWM1_BED_HEATER: R4.2 U$2.9(A3) ; also sheet 1
PWM1_BED_HEATER_HV: R55.1 U$2.8(Y3) U$14.P$1(PIN)
VM: J10.1 J16.1 R61.2 R62.2 R63.2 U$1.P$2(P2) U$4.P$2(P2) U$5.P$2(P2) U$6.P$2(P2) ; also sheet 2,3,5,6
Unconnected: U$2.1(OE1) U$2.11(Y4) U$2.13(OE4)

### Notes on the sheet
- Bed FET VIN
- Large FETS (LFPAK 10A)
- Small FET (Fan FET .5A)

## Sheet 5 of 6: SD/EXP/Serial Conn./Switches
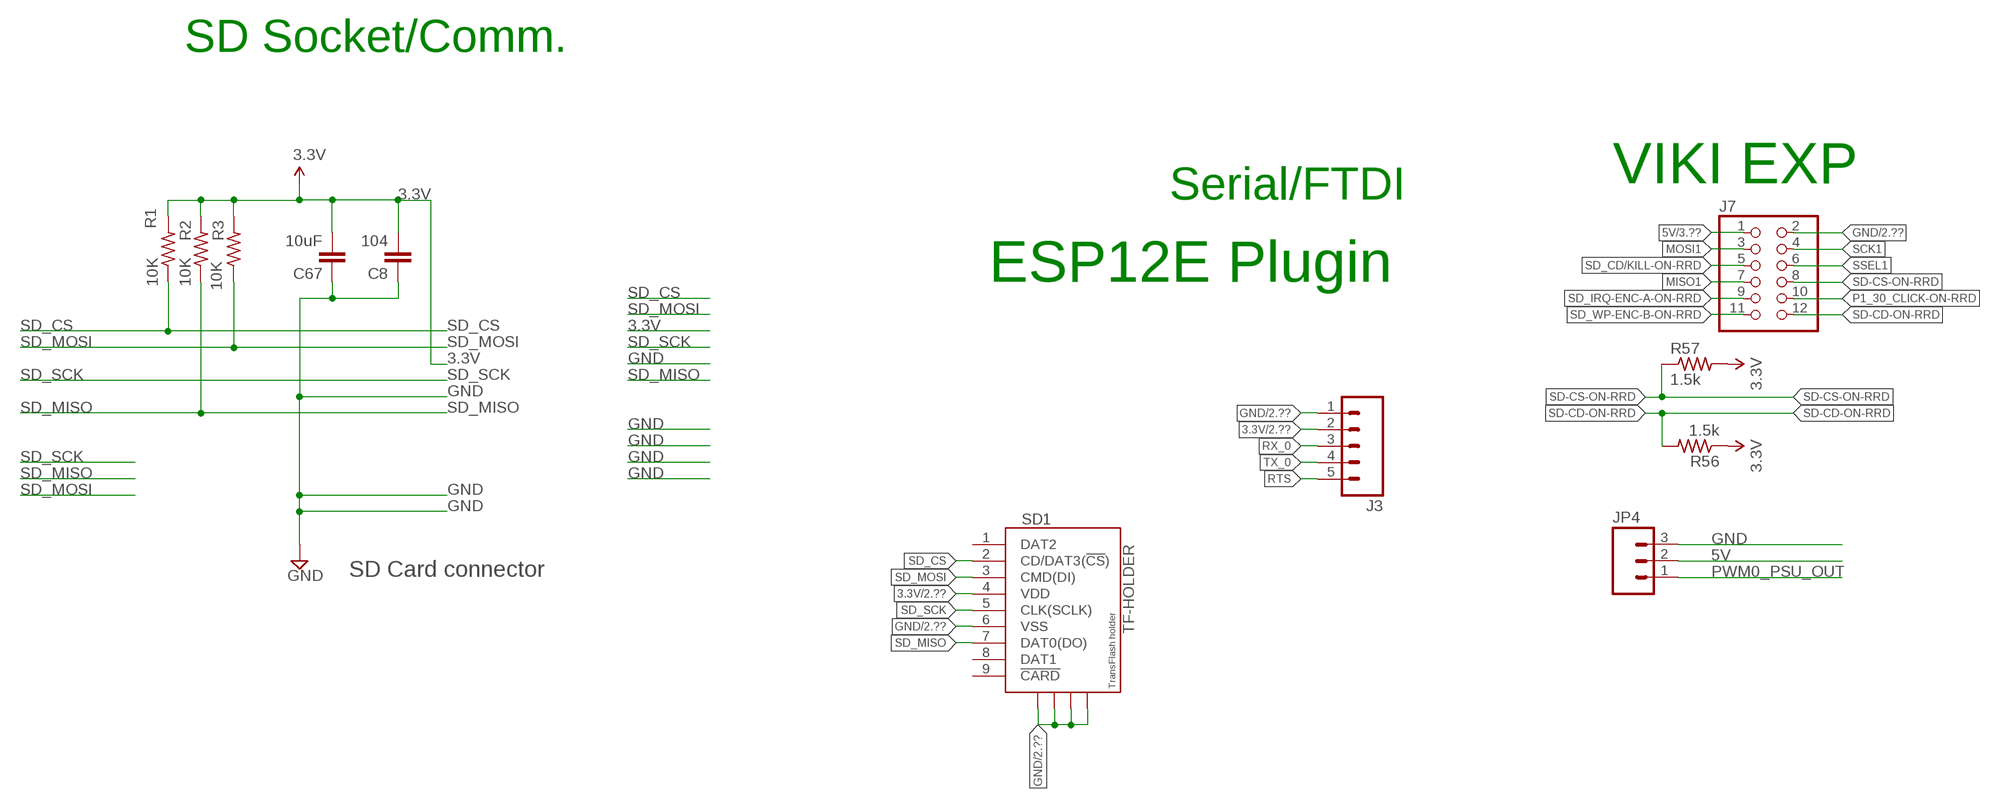
[diagram p5: schematic, sheet 5, part 1 of 2]
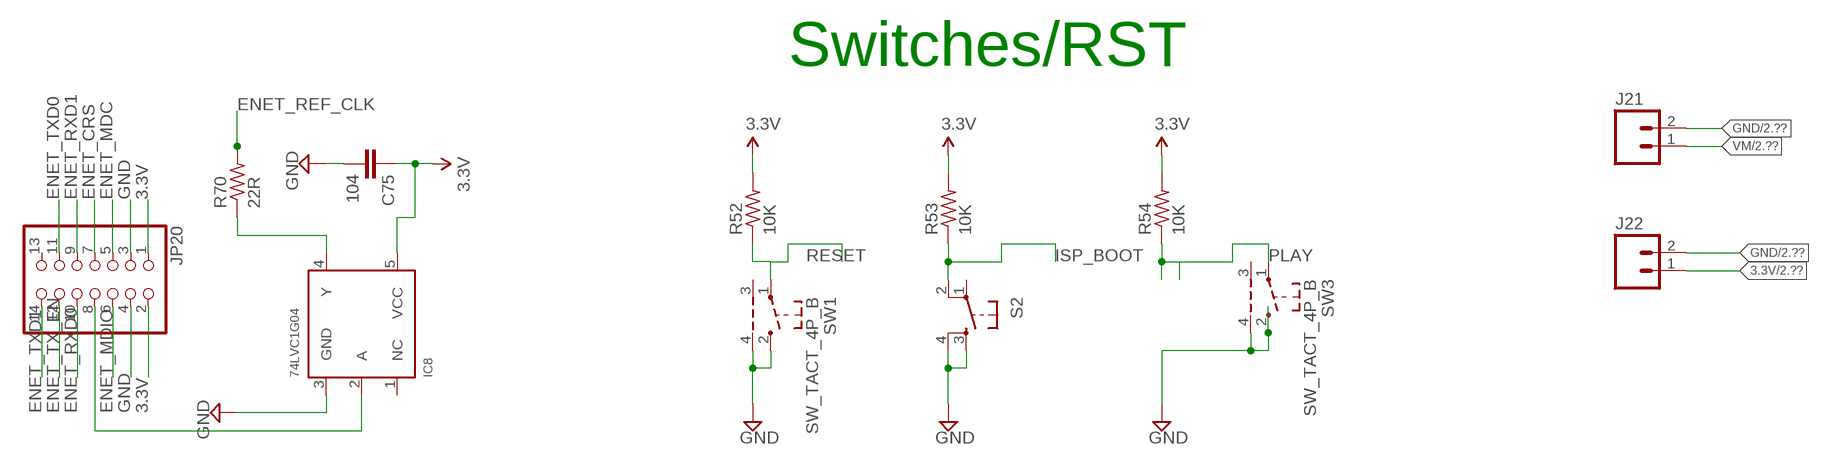
[diagram p6: schematic, sheet 5, part 2 of 2]

### Parts
C8  104  C-EUC0402  [C0402]
C67  10uF  C-EUC0402  [C0402]
C75  104  C-EUC0402  [C0402]
IC8  74LVC1G04  [SOT23-5]
J3  M05PTH  [1X05]
J7  PINHD-2X6  [2X06]
J21  M02PTH  [1X02]
J22  M02PTH  [1X02]
JP4  M03POLAR_LOCK  [MOLEX-1X3_LOCK]
JP20  PINHD-2X7  [2X07]
R1  10K  R-US_R0402  [R0402]
R2  10K  R-US_R0402  [R0402]
R3  10K  R-US_R0402  [R0402]
R52  10K  R-US_R0402  [R0402]
R53  10K  R-US_R0402  [R0402]
R54  10K  R-US_R0402  [R0402]
R56  1.5k  R-US_R0402  [R0402]
R57  1.5k  R-US_R0402  [R0402]
R70  22R  R-US_R0402  [R0402]
S2  TAC_SWITCHSMD  [TACTILE_SWITCH_SMD]
SD1  TF-HOLDER  [TF-PULL]
SW1  SW_TACT_4P_B  [SW_TACT_STANDARD_RIGHT_ANGLE]
SW3  SW_TACT_4P_B  [SW_TACT_STANDARD_RIGHT_ANGLE]

### Nets
3.3V: C8.2 C67.2 C75.1 IC8.5(VCC) J3.2 J22.1 JP20.1 JP20.2 R1.2 R2.2 R3.2 R52.2 R53.2 R54.2 R56.1 R57.2 SD1.4(VDD) ; also sheet 1,2,3,6
5V: J7.1 JP4.2 ; also sheet 1,3,4,6
ENET_CRS: JP20.7 ; also sheet 1
ENET_MDC: JP20.5 ; also sheet 1
ENET_MDIO: JP20.6 ; also sheet 1
ENET_REF_CLK: R70.2 ; also sheet 1
ENET_RXD0: JP20.10 ; also sheet 1
ENET_RXD1: JP20.9 ; also sheet 1
ENET_TX_EN: JP20.12 ; also sheet 1
ENET_TXD0: JP20.11 ; also sheet 1
ENET_TXD1: JP20.14 ; also sheet 1
GND: C8.1 C67.1 C75.2 IC8.3(GND) J3.1 J7.2 J21.2 J22.2 JP4.3 JP20.3 JP20.4 S2.3 S2.4 SD1.6(VSS) SD1.S1 SD1.S2 SD1.S3 SD1.S4 SW1.2 SW1.4 SW3.2 SW3.4 ; also sheet 1,2,3,4,6
ISP_BOOT: R53.1 S2.2 ; also sheet 1
MISO1: J7.7 ; also sheet 1
MOSI1: J7.3 ; also sheet 1
N$77: IC8.2(A) JP20.8
N$78: IC8.4(Y) R70.1
P1_30_CLICK-ON-RRD: J7.10 ; also sheet 1
PLAY: R54.1 SW3.1 ; also sheet 1
PWM0_PSU_OUT: JP4.1 ; also sheet 1
RESET: R52.1 SW1.1 ; also sheet 1
RTS: J3.5
RX_0: J3.3 ; also sheet 1
SCK1: J7.4 ; also sheet 1
SD-CD-ON-RRD: J7.12 R56.2 ; also sheet 1
SD-CS-ON-RRD: J7.8 R57.1 ; also sheet 1
SD_CD/KILL-ON-RRD: J7.5 ; also sheet 1
SD_CS: R1.1 SD1.2(CD/DAT3(!CS!)) ; also sheet 1
SD_IRQ-ENC-A-ON-RRD: J7.9 ; also sheet 1
SD_MISO: R2.1 SD1.7(DAT0(DO)) ; also sheet 1
SD_MOSI: R3.1 SD1.3(CMD(DI)) ; also sheet 1
SD_SCK: SD1.5(CLK(SCLK)) ; also sheet 1
SD_WP-ENC-B-ON-RRD: J7.11 ; also sheet 1
SSEL1: J7.6 ; also sheet 1
TX_0: J3.4 ; also sheet 1
VM: J21.1 ; also sheet 2,3,4,6
Unconnected: IC8.1(NC) JP20.13 S2.1 SD1.1(DAT2) SD1.8(DAT1) SD1.9(!CARD) SW1.3 SW3.3

### Notes on the sheet
- SD Socket/Comm.
- Switches/RST
- VIKI EXP
- Serial/FTDI
- ESP12E Plugin
- SD Card connector

## Sheet 6 of 6: Endstops/Thermistors/LED's
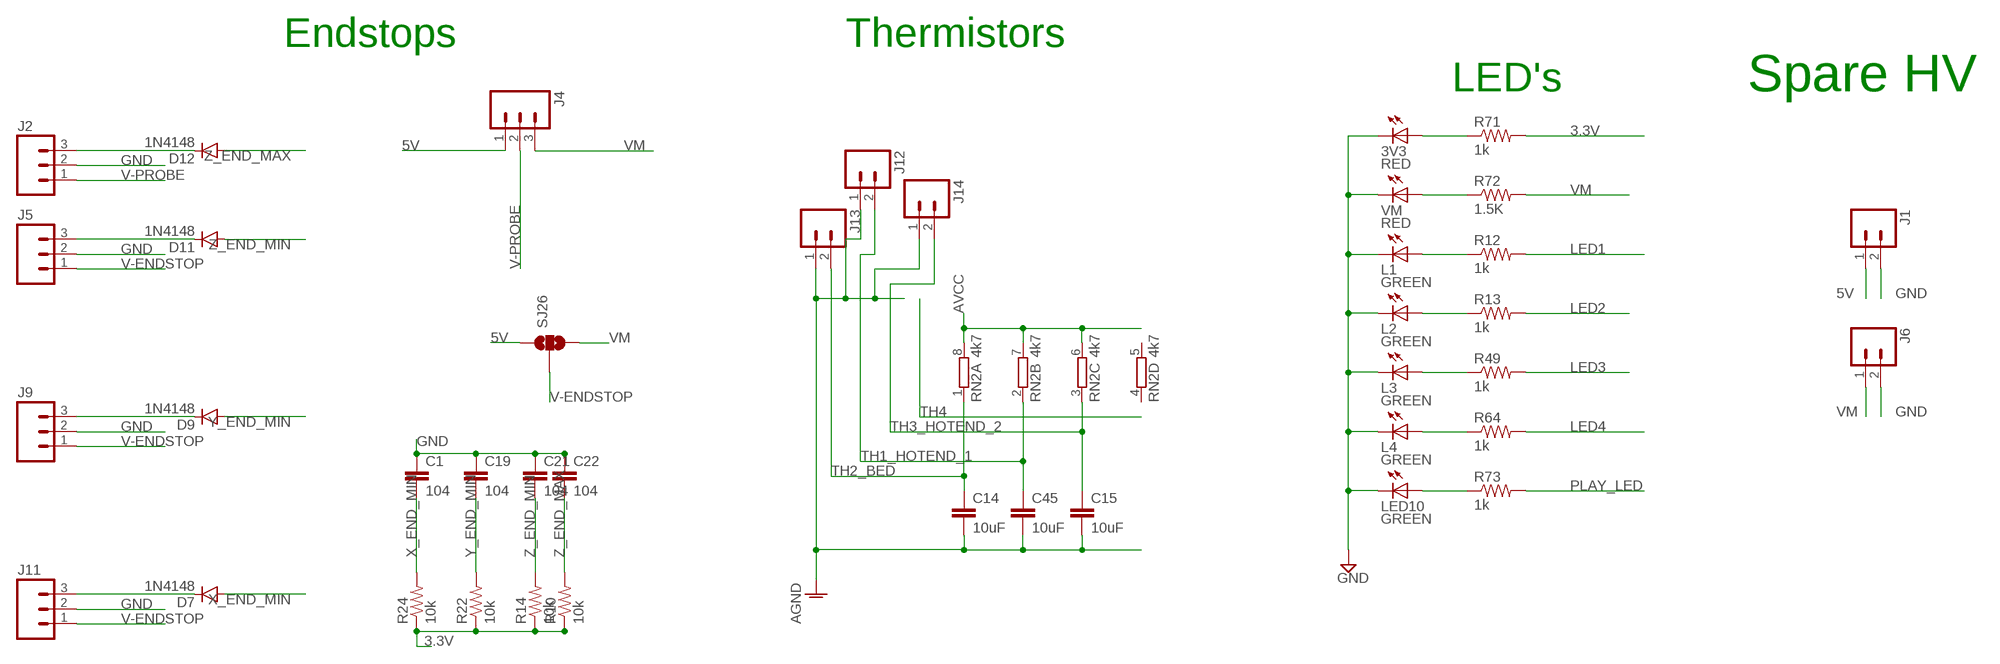
[diagram p7: schematic, sheet 6]

### Parts
3V3  RED  LEDSML0603  [SML0603]
C1  104  C-EUC0402  [C0402]
C14  10uF  C-EUC0402  [C0402]
C15  10uF  C-EUC0402  [C0402]
C19  104  C-EUC0402  [C0402]
C21  104  C-EUC0402  [C0402]
C22  104  C-EUC0402  [C0402]
C45  10uF  C-EUC0402  [C0402]
D7  1N4148  DIODEBAS16  [SOD-323]
D9  1N4148  DIODEBAS16  [SOD-323]
D11  1N4148  DIODEBAS16  [SOD-323]
D12  1N4148  DIODEBAS16  [SOD-323]
J1  M02POLAR_LOCK  [MOLEX-1X2_LOCK]
J2  M03POLAR_LOCK  [MOLEX-1X3_LOCK]
J4  M03PTH  [1X03]
J5  M03POLAR_LOCK  [MOLEX-1X3_LOCK]
J6  M02POLAR_LOCK  [MOLEX-1X2_LOCK]
J9  M03POLAR_LOCK  [MOLEX-1X3_LOCK]
J11  M03POLAR_LOCK  [MOLEX-1X3_LOCK]
J12  M02POLAR_LOCK  [MOLEX-1X2_LOCK]
J13  M02POLAR_LOCK  [MOLEX-1X2_LOCK]
J14  M02POLAR_LOCK  [MOLEX-1X2_LOCK]
L1  GREEN  LEDSML0603  [SML0603]
L2  GREEN  LEDSML0603  [SML0603]
L3  GREEN  LEDSML0603  [SML0603]
L4  GREEN  LEDSML0603  [SML0603]
LED10  GREEN  LEDSML0603  [SML0603]
R10  10k  R-US_R0402  [R0402]
R12  1k  R-US_R0402  [R0402]
R13  1k  R-US_R0402  [R0402]
R14  10k  R-US_R0402  [R0402]
R22  10k  R-US_R0402  [R0402]
R24  10k  R-US_R0402  [R0402]
R49  1k  R-US_R0402  [R0402]
R64  1k  R-US_R0402  [R0402]
R71  1k  R-US_R0402  [R0402]
R72  1.5K  R-US_R0402  [R0402]
R73  1k  R-US_R0402  [R0402]
RN2  4k7  4R-N0603-ARV  [0603-ARV]
SJ26  SOLDERJUMPER_2WAYS  [SJ_3]
VM  RED  LEDSML0603  [SML0603]

### Nets
3.3V: R10.1 R14.1 R22.1 R24.1 R71.2 ; also sheet 1,2,3,5
5V: J1.1 J4.1 SJ26.1 ; also sheet 1,3,4,5
AGND: C14.2 C15.2 C45.2 J12.1 J13.1 J14.1 ; also sheet 1
AVCC: RN2.6 RN2.7 RN2.8 ; also sheet 1
GND: 3V3.C C1.1 C19.1 C21.1 C22.1 J1.2 J2.2 J5.2 J6.2 J9.2 J11.2 L1.C L2.C L3.C L4.C LED10.C VM.C ; also sheet 1,2,3,4,5
LED1: R12.2 ; also sheet 1
LED2: R13.2 ; also sheet 1
LED3: R49.2 ; also sheet 1
LED4: R64.2 ; also sheet 1
N$32: R72.1 VM.A
N$33: 3V3.A R71.1
N$34: LED10.A R73.1
N$84: L4.A R64.1
N$85: L3.A R49.1
N$86: L2.A R13.1
N$87: L1.A R12.1
PLAY_LED: R73.2 ; also sheet 1
TH1_HOTEND_1: C45.1 J12.2 RN2.2 ; also sheet 1
TH2_BED: C14.1 J13.2 RN2.1 ; also sheet 1
TH3_HOTEND_2: C15.1 J14.2 RN2.3 ; also sheet 1
V-ENDSTOP: J5.1 J9.1 J11.1 SJ26.2
V-PROBE: J2.1 J4.2
VM: J4.3 J6.1 R72.2 SJ26.3 ; also sheet 2,3,4,5
X_END_MIN: C1.2 D7.A R24.2 ; also sheet 1
XMN: D7.C J11.3
Y_END_MIN: C19.2 D9.A R22.2 ; also sheet 1
YMN: D9.C J9.3
Z_END_MAX: C22.2 D12.A R10.2 ; also sheet 1
Z_END_MIN: C21.2 D11.A R14.2 ; also sheet 1
ZMN: D11.C J5.3
ZMX: D12.C J2.3
Unconnected: RN2.4 RN2.5

### Notes on the sheet
- Endstops | Thermistors
- LED's | Spare HV

## Library data of the parts
3V3 L1-L4 LED6-LED8 LED10 VM = led:LED: LED OSRAM: - CHIPLED LG R971, LG N971, LY N971, LG Q971, LY Q971, LO R971, LY R971 LH N974, LH R974 LS Q976, LO Q976, LY Q976 LO Q996 - Hyper CHIPLED LW Q18S LB Q993, LB Q99A, LB R99A - SideLED LS A670, LO A670, LY A670, LG A670, LP A670 LB A673, LV A673, LT A673, LW A673 LH A674 LY A675 LS A676, LA A676, LO A676, LY A676, LW A676 LS A679, LY A679, LG A679 - Hyper Micro SIDELED® LS Y876, LA Y876, LO Y876, LY Y876 LT Y87S - SmartLED LW L88C, LW L88S LB L89C, LB L89S, LG L890 LS L89K, LO L89K, LY L89K LS L896, LA L896, LO L896, LY L896 - TOPLED LS T670, LO T670, LY T670, LG T670, LP T670 LSG T670, LSP T670, LSY T670, LOP T670, LYG T670 LG T671, LOG T671, LSG T671 LB T673, LV T673, LT T673, LW T673 LH T674 LS T676, LA T676, LO T676, LY T676, LB T676, LH T676, LSB T676, LW T676 LB T67C, LV T67C, LT T67C, LS T67K, LO T67K, LY T67K, LW E67C LS E67B, LA E67B, LO E67B, LY E67B, LB E67C, LV E67C, LT E67C LW T67C LS T679, LY T679, LG T679 LS T770, LO T770, LY T770, LG T770, LP T770 LB T773, LV T773, LT T773, LW T773 LH T774 LS E675, LA E675, LY E675, LS T675 LS T776, LA T776, LO T776, LY T776, LB T776 LHGB T686 LT T68C, LB T68C - Hyper Mini TOPLED® LB M676 - Mini TOPLED Santana® LG M470 LS M47K, LO M47K, LY M47K Source: http://www.osram.convergy.de LUXEON: - LUMILED® LXK2-PW12-R00, LXK2-PW12-S00, LXK2-PW14-U00, LXK2-PW14-V00 LXK2-PM12-R00, LXK2-PM12-S00, LXK2-PM14-U00 LXK2-PE12-Q00, LXK2-PE12-R00, LXK2-PE12-S00, LXK2-PE14-T00, LXK2-PE14-U00 LXK2-PB12-K00, LXK2-PB12-L00, LXK2-PB12-M00, LXK2-PB14-N00, LXK2-PB14-P00, LXK2-PB14-Q00 LXK2-PR12-L00, LXK2-PR12-M00, LXK2-PR14-Q00, LXK2-PR14-R00 LXK2-PD12-Q00, LXK2-PD12-R00, LXK2-PD12-S00 LXK2-PH12-R00, LXK2-PH12-S00 LXK2-PL12-P00, LXK2-PL12-Q00, LXK2-PL12-R00 Source: www.luxeon.com KINGBRIGHT: KA-3528ASYC Source: www.kingbright.com
C1-C12 C14-C17 C19-C27 C35 C45 C47 C55 C63 C67 C70 C73-C75 = rcl:C-EU: CAPACITOR, European symbol
C13 C28-C30 C32-C34 C39-C44 C46 C48-C54 C56-C62 C64-C66 C68 C69 C71 C72 = we-rcl:CAPACITOR: Capacitors ...4.7uF @ 6.3V -> 0402 ...10uF @ 16V -> 0603 ...22uF @ 25V -> 0805
C36-C38 = rcl:CPOL-EU: POLARIZED CAPACITOR, European symbol
D1 D3 = microbuilder:DIODE: Diode
D2 = dp_devices:DIODE: Various Diode Packages
D7 D9 D11 D12 = SparkFun-DiscreteSemi:DIODE: Diode; PROD_ID: DIO-09646; VALUE: 250mA/100V
IC1 = microbuilder:LPC1768: LPC1768 100 MHz 32-bit ARM Cortex-M3 based microcontroller featuring a high level of integration and low power consumption. 512 kB Flash, 64 kB SRAM, USB Device/Host/OTG, Ethernet, CAN, I2S, 10-bit DAC Digikey: 568-4796-ND
IC2-IC6 = we-chip:TMC21X0: Trinamic TMC21x0 Stepper Motor Driver (5V...46V, 1.2A RMS, 256 microsteps)
IC7 IC9 = Geos:MCP44X1: MCP44x1 MCP4451 - ? Quad Resistor Network ? I2C Serial Interface Support ? Potentiometer or Rheostat Configuration Options ? Resistor Network Resolution: 7-bit ? 128 Resistors (129 Taps) 8-bit ? 256 Resistors (257 Taps)
IC8 = microbuilder:74LVC1G04: 74LVC1G04 - Single Inverter Gate SOT23-5 SN74LVC1G04DBVR - Digikey: 296-11599-1-ND
INDUCTOR2 = Inductors-Griff:L_: INDUCTOR
J1 J6 J10 J12-J14 J21 J22 = SparkFun-Connectors:M02: Standard 2-pin 0.1" header. Use with - straight break away headers ( PRT-00116) - right angle break away headers (PRT-00553) - swiss pins (PRT-00743) - machine pins (PRT-00117) - female headers (PRT-00115) Molex polarized connector foot print use with: PRT-08233 with associated crimp pins and housings. 2.54_SCREWTERM for use with PRT-10571. 3.5mm Screw Terminal footprints for PRT-08084 5mm Screw Terminal footprints for use with PRT-08432
J2 J4 J5 J9 J11 J16 J20 JP4 = SparkFun-Connectors:M03: Header 3 Standard 3-pin 0.1" header. Use with straight break away headers (SKU : PRT-00116), right angle break away headers (PRT-00553), swiss pins (PRT-00743), machine pins (PRT-00117), and female headers (PRT-00115). Molex polarized connector foot print use with SKU : PRT-08232 with associated crimp pins and housings.
J3 = SparkFun-Connectors:M05: Header 5 Standard 5-pin 0.1" header. Use with straight break away headers (SKU : PRT-00116), right angle break away headers (PRT-00553), swiss pins (PRT-00743), machine pins (PRT-00117), and female headers (PRT-00115). Molex polarized connector foot print use with SKU : PRT-08230 with associated crimp pins and housings.
J7 = pinhead:PINHD-2X6: PIN HEADER
J8 J15 J17-J19 = SparkFun-Connectors:M04: Header 4 Standard 4-pin 0.1" header. Use with straight break away headers (SKU : PRT-00116), right angle break away headers (PRT-00553), swiss pins (PRT-00743), machine pins (PRT-00117), and female headers (PRT-00115). Molex polarized connector foot print use with SKU : PRT-08231 with associated crimp pins and housings. 1MM SMD Version SKU: PRT-10208
JP20 = pinhead:PINHD-2X7: PIN HEADER
LADC = rc-master-smd:L_: INDUCTOR
Q1 = transistor-fet:BSL207SP: OptiMOS(R)-P Small-Signal-Transistor P-Channel, Enhancement mode, Super Logic Level (2.5 V rated) Source: http://www.infineon.com/upload/Document/BSL207SP_Rev2.01.pdf
Q2 = microbuilder:CRYSTAL: Crystals HC49UP - Surface Mount Crystal 4.0MHz 18pF +/-30ppm Surface Mount Crystal [Digikey: 535-9857-1-ND] 12.0 MHz Surface Mount Crystal [Digikey: 535-9869-6-ND] 25.0 MHz Surface Mount Crystal [Digikey: 535-9078-1-ND] 2.5 x 2.0mm - MEMs SMT Crystal 16.0 MHz 10pF 20ppm 2.5 x 2.0mm Crystal [Digikey -40-85°C: 535-10923-1-ND] 3.2 x 2.5mm - MEMs SMT Crystal 12.0 MHz 8pF 15ppm 3.2 x 2.5mm Crystal [Digikey: -10-70°C: 644-1047-1-ND -40-125°C: 644-1128-1-ND] 16.0 MHz 8pF 15ppm 3.2 x 2.5mm Crystal [Digikey: -10-70°C: 644-1049-1-ND -40-125°C: 644-1129-2-ND] 16.0 MHz 10pF 10ppm 3.2 x 2.5mm Crystal [Digikey: 644-1100-1-ND] 27.12 MHz 18pF 30ppm 3.2 x 2.5mm Crystal [Digikey: 887-1424-1-ND] 27.12MHz 10pF 10ppm 3.2 x 2.5mm Crystal [Digikey: 887-1329-1-ND] 4.9 x 1.8mm - MEMs SMT Crystal 32.768 KHz 12.5pF 20ppm 4.9 x 1.8mm Crystal [Digikey: SE2415CT-ND] 8.0 x 3.8mm - Surface Mount Crystal 32.768kHz 12.5pF 20ppm -40°C-85°C [Digikey: 535-9166-2-ND] Cylinder 32.768KHz Cylinder Crystal (2x6mm body) [Ex. Digikey: 300-8341-2-ND]
Q3-Q5 = Griff mosfets:PH7030L: N-channel TrenchMOS (TM) logic level FET Source: http://www.nxp.com/acrobat_download/datasheets/PH7030L_4.pdf
R1-R4 R7-R14 R18-R25 R37 R40-R64 R70-R73 = rcl:R-US_: RESISTOR, American symbol
R5 R6 R26 R27 R29 R30 R32 R34 R36 R38 = rcl:R-EU_: RESISTOR, European symbol
R16 R28 R31 R35 R39 R65-R69 = we-rcl:RESISTOR: Resistors all kinds in 0603 and 0402
RN2 = resistor-dil:4R-N: Array Chip Resistor Source: RS Component / Phycomp; OC_FARNELL: unknown; OC_NEWARK: unknown
S2 = SparkFun:TAC_SWITCH: Momentary Switch Button commonly used for reset or general input. Spark Fun Electronics SKU : COM-00097
SD1 = sd-mmc:TF-HOLDER: TF / Micro SD socket is PUSH-PUSH type, the card can be pushed into and auto locked and pushed out by simply press the card. Surface Mounting type.
SJ1 = jumper:SJ: SMD solder JUMPER
SJ26 = SparkFun:SOLDERJUMPER_2WAY: Solder Jumper 2 way solder jumper
SW1 SW3 = dp_devices:SW_TACT_4P_B
T1 T2 = transistor:*-NPN-: NPN Transistror BF959 corrected 2008.03.06
U1 = LM25011MY:LM25011MY: On-Time Switching Regulator; AVAILABILITY: Good; DESCRIPTION: 6-42V Wide Vin, 2A Constant-On Time Non-Synchronous Buck Regulator with Adjustable Current Limit 10-MSOP-PowerPAD -40...; MF: Texas Instruments; MP: LM25011MY/NOPB; PACKAGE: MSOP-10 Texas Instruments; PRICE: 1.71 USD
U2 = SparkFun-PowerIC:V_REG_LM1117: Voltage Regulator LM1117 Standard adjustable voltage regulator but in SMD form. Spark Fun Electronics SKU : COM-00595; PROD_ID: VREG-08170
U$1 U$4-U$6 = Kefa_Connectors:KF635-6.35MM-2P
U$2 = Gate Drivers:MC74VHCT125ADTRG
U$7-U$14 = Programming-Pads:SMALL_PAD
X14 = SparkFun:USB: USB Connectors USB-B-PTH is fully proven SKU : PRT-00139 USB-miniB is fully proven SKU : PRT-00587 USB-A-PCB is untested. USB-A-H is throughly reviewed, but untested. Spark Fun Electronics SKU : PRT-00437 USB-B-SMT is throughly reviewed, but untested. Needs silkscreen touching up. USB-A-S has not been used/tested USB-MB-H has not been used/tested

## Net classes
5 3.3-Amp Class: width 1.27 mm